# EAGLE design module-encoders (EAGLE 7.4.0)
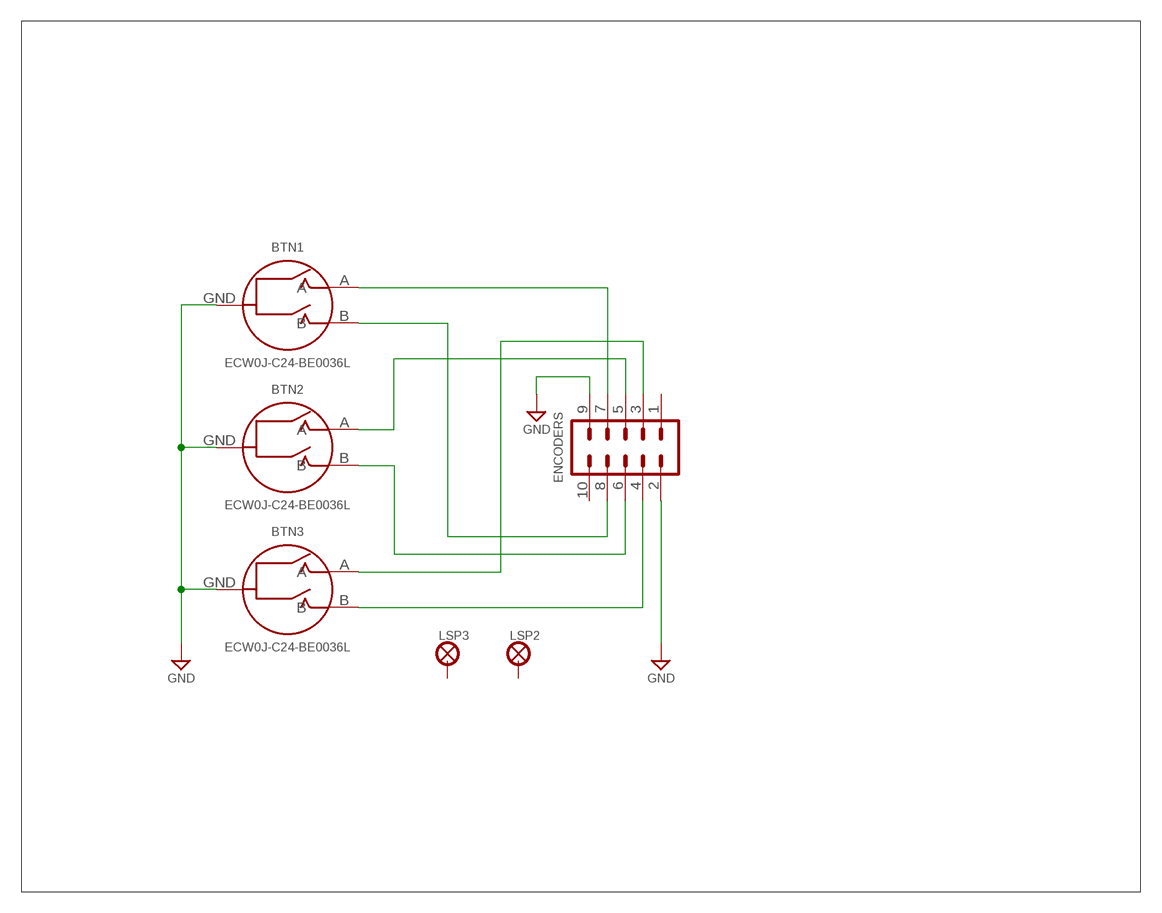
[diagram p0: schematic, sheet 1]

## Parts
BTN1  ECW0J-C24-BE0036L  ENCODER-ECW0J-C24  [ECW0J-C24]
BTN2  ECW0J-C24-BE0036L  ENCODER-ECW0J-C24  [ECW0J-C24]
BTN3  ECW0J-C24-BE0036L  ENCODER-ECW0J-C24  [ECW0J-C24]
ENCODERS  MA05-2  [MA05-2]
LSP2  LSP27  [LSP27]
LSP3  LSP27  [LSP27]

## Nets
GND: BTN1.GND BTN2.GND BTN3.GND ENCODERS.2 ENCODERS.9
N$1: BTN3.B ENCODERS.4
N$2: BTN2.B ENCODERS.6
N$3: BTN1.B ENCODERS.8
N$4: BTN2.A ENCODERS.5
N$5: BTN1.A ENCODERS.7
N$6: BTN3.A ENCODERS.3
Unconnected: ENCODERS.1 ENCODERS.10 LSP2.MP LSP3.MP

## Library data of the parts
BTN1-BTN3 = MyComponents:ENCODER-ECW0J-C24: Incremental encoder / quadrature output; MOUSER: ECW0J-C24-BE0036L
ENCODERS = MyComponents:MA05-2: Headers & Wire Housing, 2 Row, 10 Position
LSP2 LSP3 = MyComponents:LSP27: Solder Pad, drill 2.75 mm

## Board
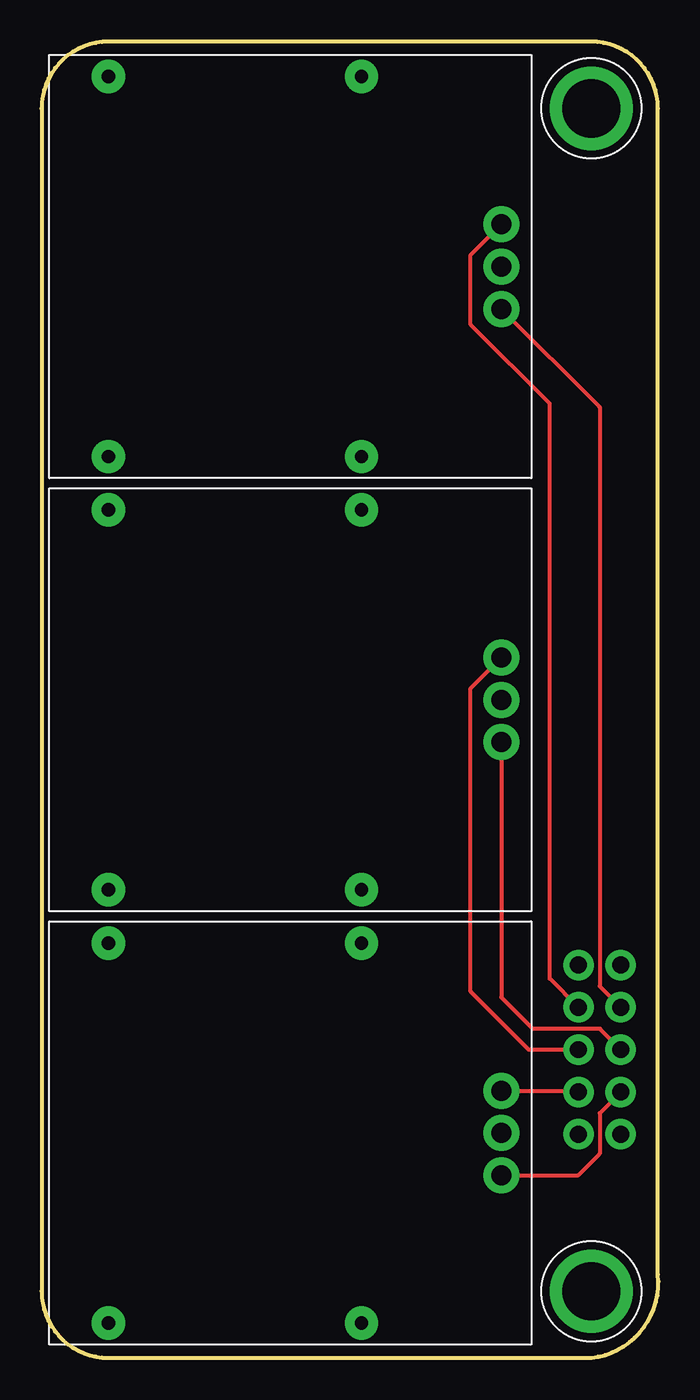
[diagram p1: board, top side]
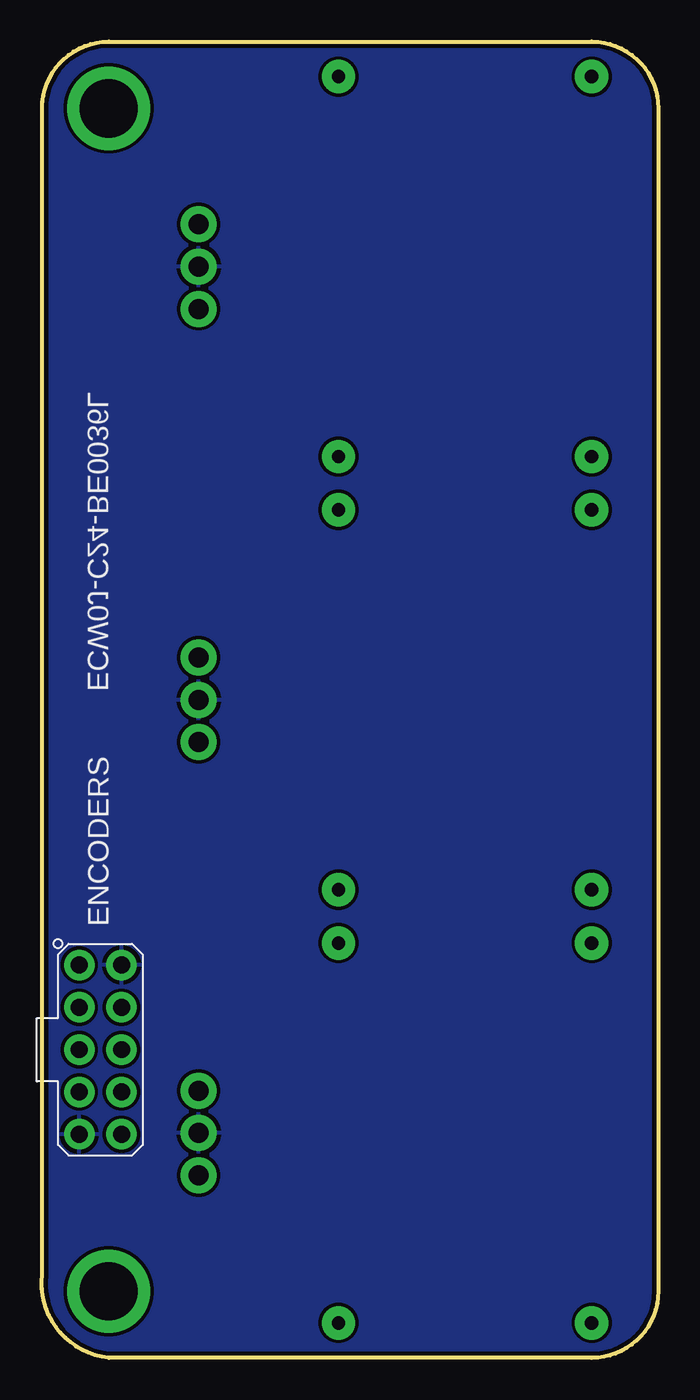
[diagram p2: board, bottom side, seen from below]

Size 37.03 x 79 mm. Coordinates in mm from the lower left corner, seen from the top.
Outline: 0,4 arc90 4,0 33,0 arc90 37,5 37,75 arc90 33,79 4,79 arc90 0,75 0,4
Copper layers (1*16): Top 0.035mm / dielectric 1.5mm / Bottom 0.035mm
Design rules "digital": minimum track width 10mil, minimum drill 19mil, track to track 8mil, track to pad 8mil, pad to pad 7mil, via to via 12mil, smd to smd 7mil, copper to edge 10mil, drill to drill 30mil, minimum pad ring 10mil, minimum via ring 8mil, stop-mask expansion 4mil, vias tented up to drill 0mil, thermal gap 10mil

### Footprints (pad centres in the part's own frame; a part is rotated, then mirrored left to right if it is on the bottom)
ECW0J-C24 = drill 1.2: A -2.54,-23.6; B 2.54,-23.6; GND 0,-23.6 | drill 0.8 pad 2: M1 11.4,0; M2 11.4,-15.2; M3 -11.4,-15.2; M4 -11.4,0
MA05-2 = drill 1.016: 1 -5.08,-1.27; 2 -5.08,1.27; 3 -2.54,-1.27; 4 -2.54,1.27; 5 0,-1.27; 6 0,1.27; 7 2.54,-1.27; 8 2.54,1.27; 9 5.08,-1.27; 10 5.08,1.27
LSP27 = drill 3.5 pad 5: MP 0,0

### Placement (x,y rotation side)
BTN1  4,13.5 90 top
BTN2  4,39.5 90 top
BTN3  4,65.5 90 top
ENCODERS  33.5,18.5 270 bottom
LSP2  33,75 0 top
LSP3  33,4 0 top

### Tracks (layer width: path | path; a pad name or v marks a point on that pad's centre or on a via)
GND
  pour Bottom (rank 4): 0,0 37,0 37,79 0,79
N$1
  Top 0.254: BTN3.B 25.75,66.19 25.75,62.02 30.5,57.27 30.5,22.77 ENCODERS.4
N$2
  Top 0.254: ENCODERS.6 29.25,18.5 25.75,22 25.75,40.19 BTN2.B
N$3
  Top 0.254: BTN1.B 32.15,16.04 ENCODERS.8
N$4
  Top 0.254: BTN2.A 27.6,21.65 29.5,19.75 33.52,19.75 ENCODERS.5
N$5
  Top 0.254: ENCODERS.7 33.5,14.69 33.5,12.25 32.21,10.96 BTN1.A
N$6
  Top 0.254: ENCODERS.3 33.5,22.31 33.5,57.06 BTN3.A